# EAGLE schematic logger v1.0 (EAGLE 5.01)
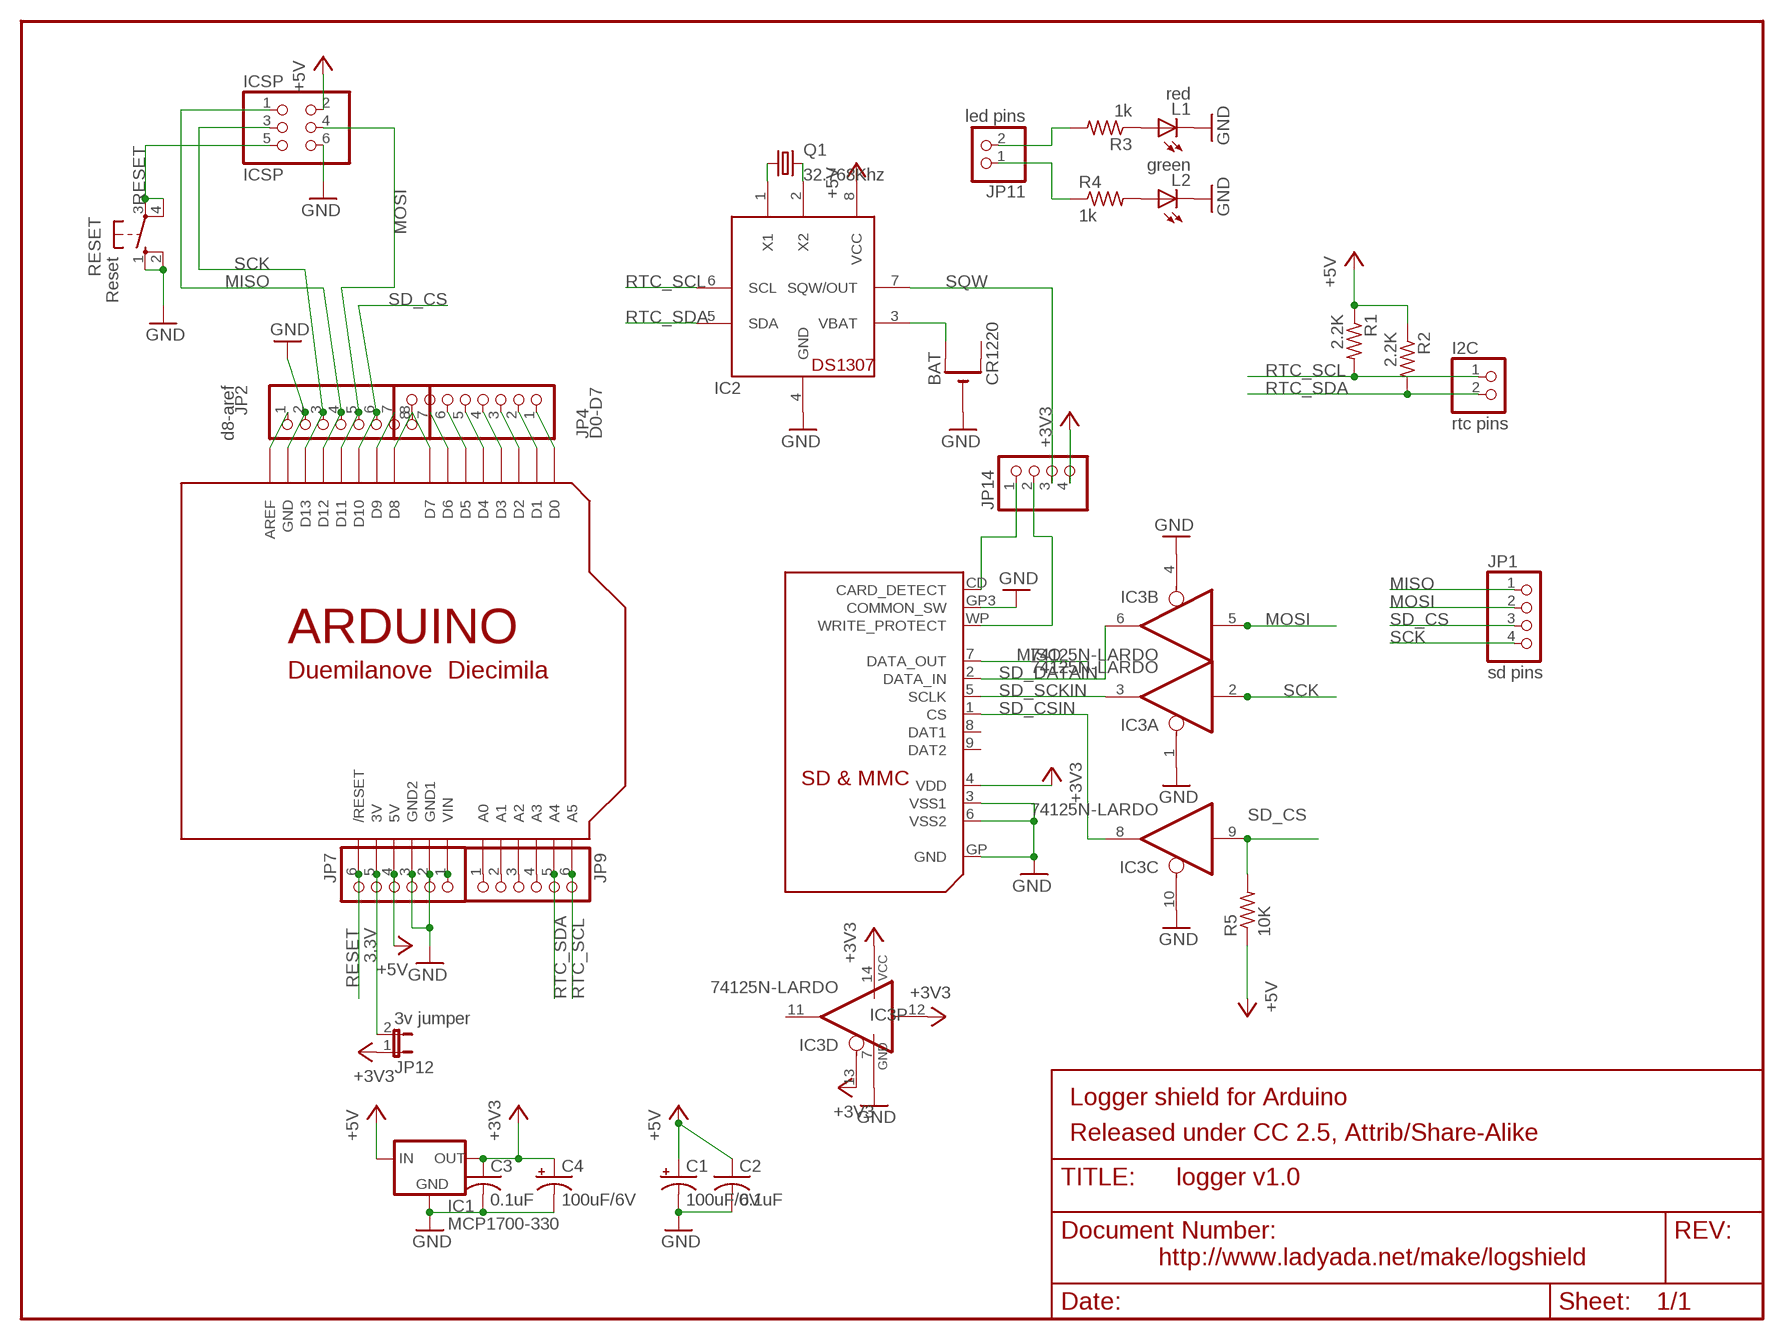
[diagram p0: schematic, sheet 1]

## Parts
BAT  CR1220  CR1220THM  [CR1220-THM]
C1  100uF/6V  CPOL-USE2.5-5  [E2,5-5]
C2  0.1uF  C-US025-025X050  [C025-025X050]
C3  0.1uF  C-US025-025X050  [C025-025X050]
C4  100uF/6V  CPOL-USE2.5-5  [E2,5-5]
I2C  rtc pins  PINHD-1X2  [1X02]
IC1  MCP1700-330  MCP1700TRI  [TO92]
IC2  DS1307  [DIL08]
IC3  74125N-LARDO  [DIL14-LARDO]
ICSP  ICSP  PINHD-2X3  [2X03]
JP1  sd pins  PINHD-1X4  [1X04]
JP2  d8-aref  PINHD-1X8BIG  [1X08-BIG]
JP4  D0-D7  PINHD-1X8BIG  [1X08-BIG]
JP7  PINHD-1X6B  [1X06-BIG]
JP9  PINHD-1X6B  [1X06-BIG]
JP11  led pins  PINHD-1X2  [1X02]
JP12  3v jumper  JP1E  [JP1]
JP14  PINHD-1X4  [1X04]
L1  red  LED3MM  [LED3MM]
L2  green  LED3MM  [LED3MM]
Q1  32.768Khz  CRYSTALTC38H  [TC38H]
R1  2.2K  R-US_0207/10  [0207/10]
R2  2.2K  R-US_0207/10  [0207/10]
R3  1k  R-US_0207/10  [0207/10]
R4  1k  R-US_0207/10  [0207/10]
R5  10K  R-US_0207/10  [0207/10]
RESET  Reset  10-XX  [B3F-10XX]
U$1  ARDUINODUEMILANOVE-NOHOLES  [ARDUINO-NOHOLE]
U$2  SDMMC06132  [06132]

## Nets
3.3V: JP7.5 JP12.2 U$1.3V
+3V3: C3.1 C4.+ IC1.3(OUT) IC3.12(D:I) IC3.13(D:OE) IC3.14(P:VCC) JP12.1 JP14.4 U$2.4(VDD)
+5V: C1.+ C2.1 IC1.2(IN) IC2.8(VCC) ICSP.2 JP7.4 R1.1 R2.1 R5.1 U$1.5V
GND: BAT.- C1.- C2.2 C3.2 C4.- IC1.1(GND) IC2.4(GND) IC3.1(A:OE) IC3.4(B:OE) IC3.7(P:GND) IC3.10(C:OE) ICSP.6 JP2.2 JP7.2 JP7.3 L1.K(C) L2.K(C) RESET.1(S) RESET.2(S1) U$1.GND U$1.GND1 U$1.GND2 U$2.3(VSS1) U$2.6(VSS2) U$2.GP3(COMMON_SW) U$2.GP(GND)
MISO: ICSP.1 JP1.1 JP2.4 U$1.D12 U$2.7(DATA_OUT)
MOSI: IC3.5(B:I) ICSP.4 JP1.2 JP2.5 U$1.D11
N$1: BAT.+1(+) IC2.3(VBAT)
N$2: IC2.1(X1) Q1.1
N$3: IC2.2(X2) Q1.2
N$14: L1.A R3.1
N$15: JP7.1 U$1.VIN
N$17: JP11.2 R3.2
N$18: L2.A R4.2
N$20: JP11.1 R4.1
N$87: JP4.1 U$1.D0
N$88: JP4.2 U$1.D1
N$89: JP4.3 U$1.D2
N$90: JP4.4 U$1.D3
N$98: JP4.5 U$1.D4
N$99: JP4.6 U$1.D5
N$100: JP4.7 U$1.D6
N$101: JP4.8 U$1.D7
N$108: JP2.1 U$1.AREF
N$110: JP2.7 U$1.D9
N$111: JP2.8 U$1.D8
N$154: JP9.1 U$1.A0
N$164: JP9.2 U$1.A1
N$181: JP9.3 U$1.A2
N$182: JP9.4 U$1.A3
RESET: ICSP.5 JP7.6 RESET.3(P) RESET.4(P1) U$1.RESET(/RESET)
RTC_SCL: I2C.1 IC2.6(SCL) JP9.6 R1.2 U$1.A5
RTC_SDA: I2C.2 IC2.5(SDA) JP9.5 R2.2 U$1.A4
SCK: IC3.2(A:I) ICSP.3 JP1.4 JP2.3 U$1.D13
SD_CD: JP14.1 U$2.CD(CARD_DETECT)
SD_CS: IC3.9(C:I) JP1.3 JP2.6 R5.2 U$1.D10
SD_CSIN: IC3.8(C:O) U$2.1(CS)
SD_DATAIN: IC3.6(B:O) U$2.2(DATA_IN)
SD_SCKIN: IC3.3(A:O) U$2.5(SCLK)
SD_WP: JP14.2 U$2.WP(WRITE_PROTECT)
SQW: IC2.7(SQW/OUT) JP14.3
Unconnected: BAT.+2(+1) IC3.11(D:O) U$2.8(DAT1) U$2.9(DAT2)

## Notes on the sheet
- Logger shield for Arduino
- Released under CC 2.5, Attrib/Share-Alike
- http://www.ladyada.net/make/logshield

## Library data of the parts
BAT = adafruit:CR1220: CR1216/CR1220/CR1225 12mm 3V lithium coin cell Great for battery packup. Both SMT and THM holders. Note the THM package has the ground pads on both sides of the PCB so that the masks are the same - this reduces the cost
C1 C4 = adafruit:CPOL-US: POLARIZED CAPACITOR, American symbol
C2 C3 = adafruit:C-US: CAPACITOR, American symbol
I2C JP11 = pinhead:PINHD-1X2: PIN HEADER
IC1 = adafruit:MCP1700: VOLTAGE REGULATOR
IC2 = adafruit:DS1307: DS1307 Real time clock (RTC) with battery backup ability. Talk to it via i2c
IC3 = adafruit:74*125: Quad bus BUFFER, 3-state
ICSP = pinhead:PINHD-2X3: PIN HEADER
JP1 JP14 = pinhead:PINHD-1X4: PIN HEADER
JP2 JP4 = adafruit:PINHD-1X8: PIN HEADER
JP7 JP9 = adafruit:PINHD-1X6: PIN HEADER
JP12 = jumper:JP1E: JUMPER
L1 L2 = adafruit:LED: LED OSRAM: - CHIPLED LG R971, LG N971, LY N971, LG Q971, LY Q971, LO R971, LY R971 LH N974, LH R974 LS Q976, LO Q976, LY Q976 LO Q996 - Hyper CHIPLED LW Q18S LB Q993, LB Q99A, LB R99A - SideLED LS A670, LO A670, LY A670, LG A670, LP A670 LB A673, LV A673, LT A673, LW A673 LH A674 LY A675 LS A676, LA A676, LO A676, LY A676, LW A676 LS A679, LY A679, LG A679 - Hyper Micro SIDELED® LS Y876, LA Y876, LO Y876, LY Y876 LT Y87S - SmartLED LW L88C, LW L88S LB L89C, LB L89S, LG L890 LS L89K, LO L89K, LY L89K LS L896, LA L896, LO L896, LY L896 - TOPLED LS T670, LO T670, LY T670, LG T670, LP T670 LSG T670, LSP T670, LSY T670, LOP T670, LYG T670 LG T671, LOG T671, LSG T671 LB T673, LV T673, LT T673, LW T673 LH T674 LS T676, LA T676, LO T676, LY T676, LB T676, LH T676, LSB T676, LW T676 LB T67C, LV T67C, LT T67C, LS T67K, LO T67K, LY T67K, LW E67C LS E67B, LA E67B, LO E67B, LY E67B, LB E67C, LV E67C, LT E67C LW T67C LS T679, LY T679, LG T679 LS T770, LO T770, LY T770, LG T770, LP T770 LB T773, LV T773, LT T773, LW T773 LH T774 LS E675, LA E675, LY E675, LS T675 LS T776, LA T776, LO T776, LY T776, LB T776 LHGB T686 LT T68C, LB T68C - Hyper Mini TOPLED® LB M676 - Mini TOPLED Santana® LG M470 LS M47K, LO M47K, LY M47K Source: http://www.osram.convergy.de/
Q1 = crystal:CRYSTAL: CRYSTAL
R1-R5 = adafruit:R-US_: RESISTOR, American symbol
RESET = switch-omron:10-XX: OMRON SWITCH
U$1 = adafruit:ARDUINO: Arduino Diecimila/Duemilanove Make a shield with ease, this package has all the named pins as well as the two mounting drill holes and an outline of the USB and DC power connector. The outline is on the DIMENSION layer, so if your board house uses it they will cut the outline to match. http://www.ladyada.net/library/pcb/eaglelibrary.html
U$2 = adafruit:SDMMC: SD MMC Card holder 4UCON part #06132 - easy to solder